# Altium schematic sheet 0028.SchDoc
size A4
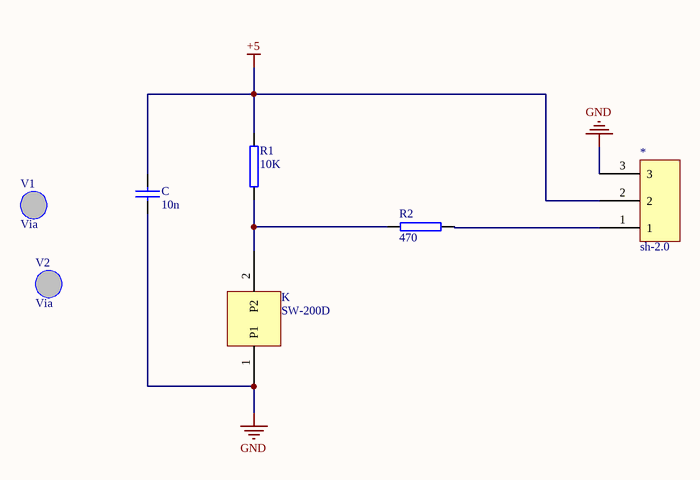
[diagram p0: 0028.SchDoc]

## Parts
*  sh-2.0  [sh-2.0]
C  10n  [0402]
K  SW-200D  [SW-200D]
R1  10K  [0402]
R2  470  [0402]
V1  Via  [Via]
V2  Via  [Via]

## Nets
+5: *.2 C.1 R1.2
GND: *.3 C.2 K.1(P1)
Net*_1: *.1 R2.2
NetK_2: K.2(P2) R1.1 R2.1

## Library data of the parts
C = CAP0402
R1 R2 = RES0402